# Altium schematic sheet Voltage Reg.SchDoc
size A; SheetNumber: 1; SheetTotal: 1
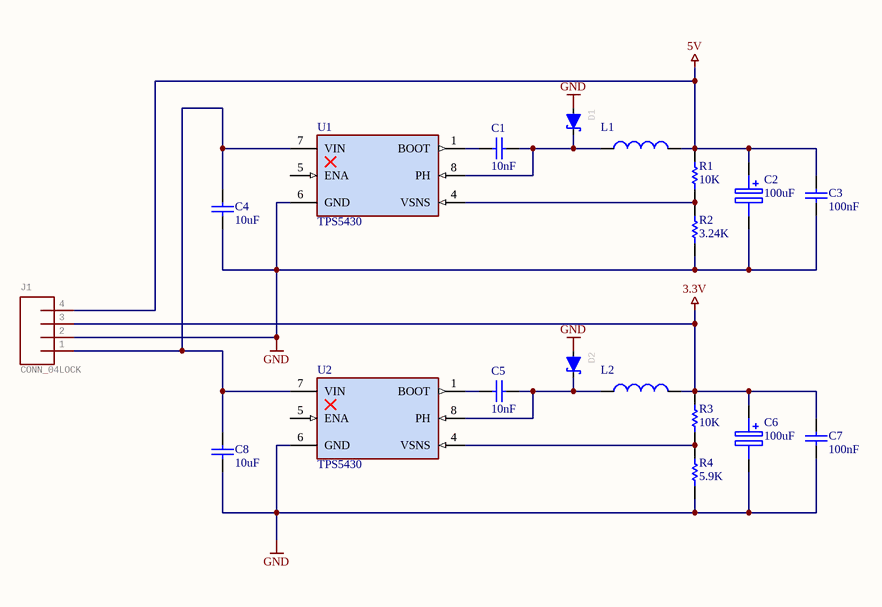
[diagram p0: Voltage Reg.SchDoc]

## Parts
C1  10nF  [CAPC1608X90X35ML10T15]
C2  value 100uF  [CAPPM7344X310N]  (hidden comment: TAJE107M025RNJ)
C3  100nF  [CAPC1608X90X35ML10T15]
C4  10uF  [CAPC1608X90X35ML10T15]
C5  10nF  [CAPC1608X90X35ML10T15]
C6  value 100uF  [CAPPM7344X310N]  (hidden comment: TAJE107M025RNJ)
C7  100nF  [CAPC1608X90X35ML10T15]
C8  10uF  [CAPC1608X90X35ML10T15]
D1  Schotty Diode  [SMA-DIODE]  (value not drawn)
D2  Schotty Diode  [SMA-DIODE]  (value not drawn)
J1  CONN_04LOCK  [1X04_LOCK]
L1  10Uh  [SWPA8040]  (value not drawn)
L2  10Uh  [SWPA8040]  (value not drawn)
R1  10K  [RESISTOR0603]
R2  3.24K  [RESISTOR0603]
R3  10K  [RESISTOR0603]
R4  5.9K  [RESISTOR0603]
U1  TPS5430  [FP-DDA0008J-MFG]
U2  TPS5430  [FP-DDA0008J-MFG]

## Nets
3.3V: C6.1(+) C7.2 J1.3 L2.P2 R3.2
5V: C2.1(+) C3.2 J1.4 L1.P2 R1.2
GND: C2.2(-) C3.1 C4.1 C6.2(-) C7.1 C8.1 D1.1 D2.1 J1.2 R2.1 R4.1 U1.6(GND) U2.6(GND)
NetC1_1: C1.1 D1.2 L1.P1 U1.8(PH)
NetC1_2: C1.2 U1.1(BOOT)
NetC4_2: C4.2 C8.2 J1.1 U1.7(VIN) U2.7(VIN)
NetC5_1: C5.1 D2.2 L2.P1 U2.8(PH)
NetC5_2: C5.2 U2.1(BOOT)
NetR1_1: R1.1 R2.2 U1.4(VSNS)
NetR3_1: R3.1 R4.2 U2.4(VSNS)

Not connected (* = marked no-connect by the designer): U1 5(ENA); U2 5(ENA)

## Library data of the parts
C1 C5 = CMP-001-00002-4: CAP 10nF; Value: 10nF
C2 C6 = CMP-092-000000-5: 25V 100UF ±20% TAJE107M025RNJ; Manufacturer_Part_Number: TAJD686K010R; Design Item ID: TAJD686K010R; Source: SamacSys.SchLib; Height: 3.1mm; Datasheet Link: http://datasheets.avx.com/TAJ.pdf
C3 C7 = CMP-001-00005-1: CAP 100nF; Value: 100nF
C4 C8 = CMP-001-00006-1: CAP 10uF; Value: 10uF
D1 D2 = CMP-066-000000-4: SMD; Pin: 2
J1 = CMP-027-000001-1: GateName_1: J1; PROD_ID: CONN-09696; DeviceName: LOCK; LibraryName: SparkFun-Connectors; Source: SparkFun-Connectors.SCHLIB; Design Item ID: CONN_04LOCK; Package: 1X04_LOCK; Pin Count: 4; DeviceSetName: CONN_04; SymbolName_1: CONN_04; Component Type: Standard
L1 L2 = CMP-068-000000-6: Inductor for 5V & 3.3V Buck; ComponentLink1URL: 10uH; ComponentLink1Description: Value
R1 R3 = CMP-009-00000-2: RES 10K 0603; Value: 10K
R2 = CMP-009-00002-1: RES 3.24K 0603; Value: 3.24K
R4 = CMP-009-00005-1: RES 5.9K 0603; Value: 5.9K
U1 U2 = CMP-071-000000-7: Step Down Converter; DeviceSetName: TPS54X0; GateName_1: G$1; Design Item ID: TPS54X0; LibraryName: JH; SymbolName_1: TPS54X0; Package: POWERPAD-SOIC-8; Pin Count: 7; Component Type: Standard